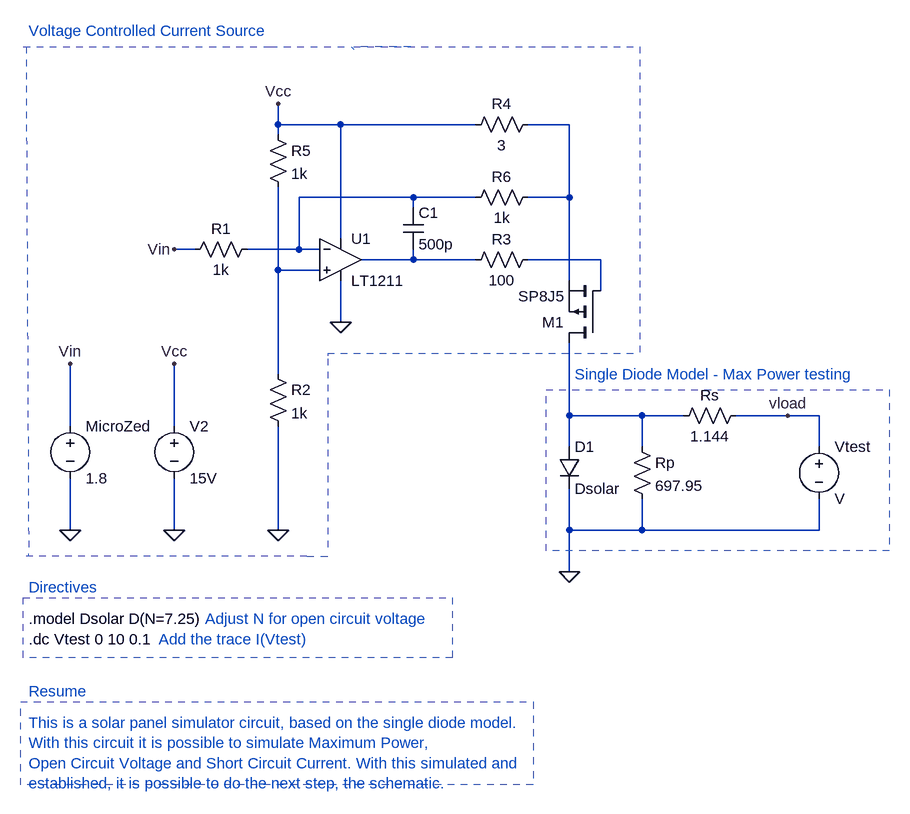
[diagram p0: schematic current-source-panels-voc-isc.asc]
current-source-panels-voc-isc.asc, the LTspice schematic file:
Version 4
SHEET 1 2736 2348
WIRE 272 96 272 64
WIRE 368 96 272 96
WIRE 576 96 368 96
WIRE 720 96 656 96
WIRE 272 112 272 96
WIRE 480 208 304 208
WIRE 576 208 480 208
WIRE 720 208 720 96
WIRE 720 208 656 208
WIRE 480 224 480 208
WIRE 368 272 368 96
WIRE 144 288 112 288
WIRE 304 288 304 208
WIRE 304 288 224 288
WIRE 336 288 304 288
WIRE 480 304 480 288
WIRE 480 304 400 304
WIRE 576 304 480 304
WIRE 768 304 656 304
WIRE 272 320 272 192
WIRE 336 320 272 320
WIRE 720 336 720 208
WIRE 768 352 768 304
WIRE 368 400 368 336
WIRE 272 480 272 320
WIRE 720 544 720 432
WIRE 832 544 720 544
WIRE 896 544 832 544
WIRE 1056 544 976 544
WIRE 1104 544 1056 544
WIRE -48 560 -48 464
WIRE 112 560 112 464
WIRE 720 592 720 544
WIRE 832 592 832 544
WIRE 1104 592 1104 544
WIRE -48 720 -48 640
WIRE 112 720 112 640
WIRE 272 720 272 560
WIRE 720 720 720 656
WIRE 832 720 832 672
WIRE 832 720 720 720
WIRE 1104 720 1104 672
WIRE 1104 720 832 720
WIRE 720 784 720 720
FLAG -48 720 0
FLAG 112 720 0
FLAG -48 464 Vin
FLAG 112 288 Vin
FLAG 112 464 Vcc
FLAG 272 64 Vcc
FLAG 368 400 0
FLAG 1056 544 vload
FLAG 720 784 0
FLAG 272 720 0
SYMBOL OpAmps/LT1211 368 240 R0
SYMATTR InstName U1
SYMBOL Res 240 272 R90
WINDOW 0 0 56 VBottom 2
WINDOW 3 32 56 VTop 2
SYMATTR InstName R1
SYMATTR Value 1k
SYMBOL Res 256 464 R0
SYMATTR InstName R2
SYMATTR Value 1k
SYMBOL Res 672 288 R90
WINDOW 0 0 56 VBottom 2
WINDOW 3 32 56 VTop 2
SYMATTR InstName R3
SYMATTR Value 100
SYMBOL pmos 768 432 R180
SYMATTR InstName M1
SYMATTR Value SP8J5
SYMBOL Res 672 80 R90
WINDOW 0 0 56 VBottom 2
WINDOW 3 32 56 VTop 2
SYMATTR InstName R4
SYMATTR Value 3
SYMBOL Res 256 96 R0
SYMATTR InstName R5
SYMATTR Value 1k
SYMBOL Res 672 192 R90
WINDOW 0 0 56 VBottom 2
WINDOW 3 32 56 VTop 2
SYMATTR InstName R6
SYMATTR Value 1k
SYMBOL Cap 464 224 R0
SYMATTR InstName C1
SYMATTR Value 500p
SYMBOL voltage -48 544 R0
SYMATTR InstName MicroZed
SYMATTR Value 1.8
SYMBOL voltage 112 544 R0
SYMATTR InstName V2
SYMATTR Value 15V
SYMBOL diode 704 592 R0
SYMATTR InstName D1
SYMATTR Value Dsolar
SYMBOL res 816 576 R0
SYMATTR InstName Rp
SYMATTR Value 697.95
SYMBOL res 992 528 R90
WINDOW 0 0 56 VBottom 2
WINDOW 3 32 56 VTop 2
SYMATTR InstName Rs
SYMATTR Value 1.144
SYMBOL voltage 1104 576 R0
SYMATTR InstName Vtest
TEXT -112 856 Left 2 !.model Dsolar D(N=7.25)
TEXT 160 856 Left 2 ;Adjust N for open circuit voltage
TEXT -112 888 Left 2 !.dc Vtest 0 10 0.1
TEXT -112 1016 Left 2 ;This is a solar panel simulator circuit, based on the single diode model.\nWith this circuit it is possible to simulate Maximum Power,\nOpen Circuit Voltage and Short Circuit Current. With this simulated and\nestablished, it is possible to do the next step, the schematic.
TEXT -112 -48 Left 2 ;Voltage Controlled Current Source
TEXT -112 968 Left 2 ;Resume
TEXT -112 808 Left 2 ;Directives
TEXT 728 480 Left 2 ;Single Diode Model - Max Power testing
TEXT 88 888 Left 2 ;Add the trace I(Vtest)
LINE Normal 316 760 -116 760 3
LINE Normal 348 456 348 756 3
LINE Normal -120 -24 124 -24 3
LINE Normal 124 -24 260 -24 3
LINE Normal 260 -24 384 -24 3
LINE Normal 384 -24 388 -20 2
LINE Normal 476 -24 388 -24 2
LINE Normal 388 -24 576 -24 3
LINE Normal 576 -24 688 -24 2
LINE Normal 688 -24 828 -24 2
LINE Normal 828 -24 828 456 3
LINE Normal 348 448 348 452 3
LINE Normal 348 448 828 448 3
LINE Normal -112 760 -112 756 3
LINE Normal -116 -24 -112 756 3
LINE Normal 316 760 348 760 3
RECTANGLE Normal -124 984 664 1112 2
RECTANGLE Normal -120 824 540 916 3
RECTANGLE Normal 684 504 1212 752 3

The netlist it stands for:
* current-source-panels-voc-isc.asc
XU1 N005 N002 Vcc 0 N003 LT1211  ; pins In+ In- V+ V- OUT
R1 N002 Vin 1k
R2 N005 0 1k
R3 N004 N003 100
M1 N006 N004 N001 N001 SP8J5
R4 N001 Vcc 3
R5 Vcc N005 1k
R6 N001 N002 1k
C1 N002 N003 500p
V§MicroZed Vin 0 1.8
V2 Vcc 0 15V
D1 N006 0 Dsolar
Rp N006 0 697.95
Rs vload N006 1.144
Vtest vload 0 V
.model D D
.lib standard.dio
.model NMOS NMOS
.model PMOS PMOS
.lib standard.mos
.model Dsolar D(N=7.25)
* Adjust N for open circuit voltage
.dc Vtest 0 10 0.1
* This is a solar panel simulator circuit, based on the single diode model.
* With this circuit it is possible to simulate Maximum Power,
* Open Circuit Voltage and Short Circuit Current. With this simulated and
* established, it is possible to do the next step, the schematic.
* Voltage Controlled Current Source
* Resume
* Directives
* Single Diode Model - Max Power testing
* Add the trace I(Vtest)
.lib LTC.lib
.backanno
.end